# EasyEDA Pro project ProProject_myXBoxGamepad_2024-06-05.epro, board PCB1_1
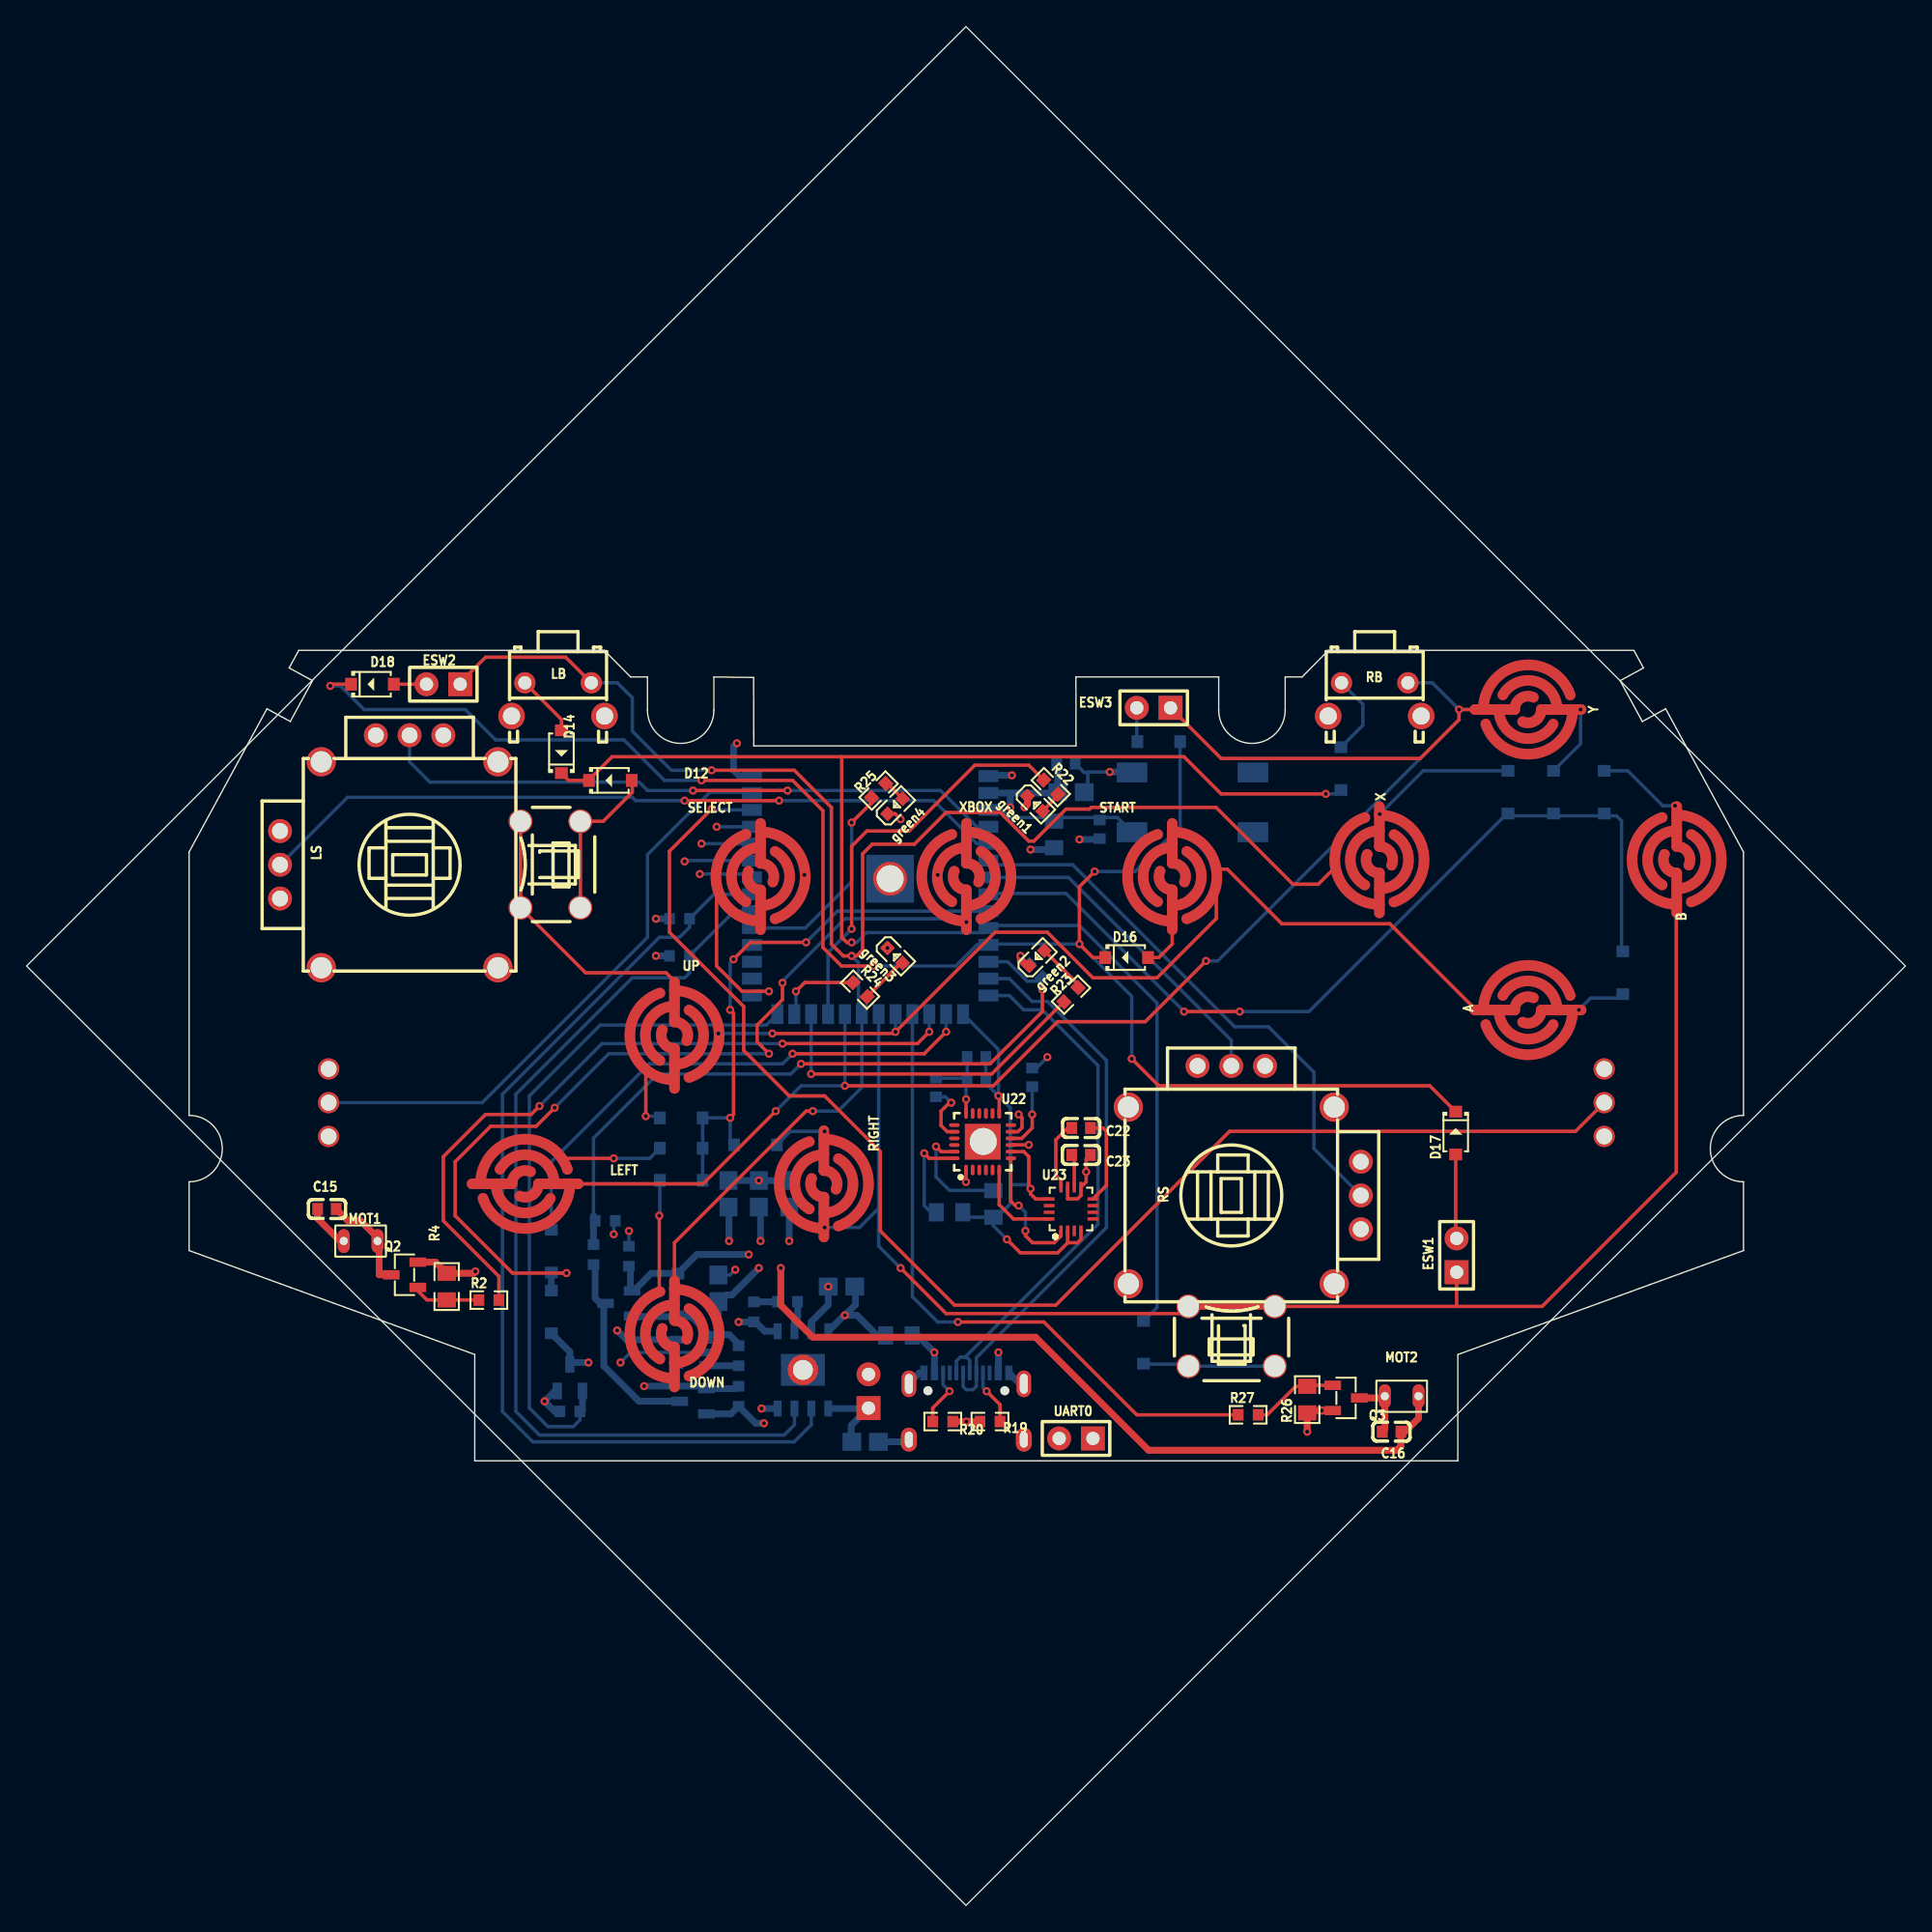
[diagram p1: board, top side]
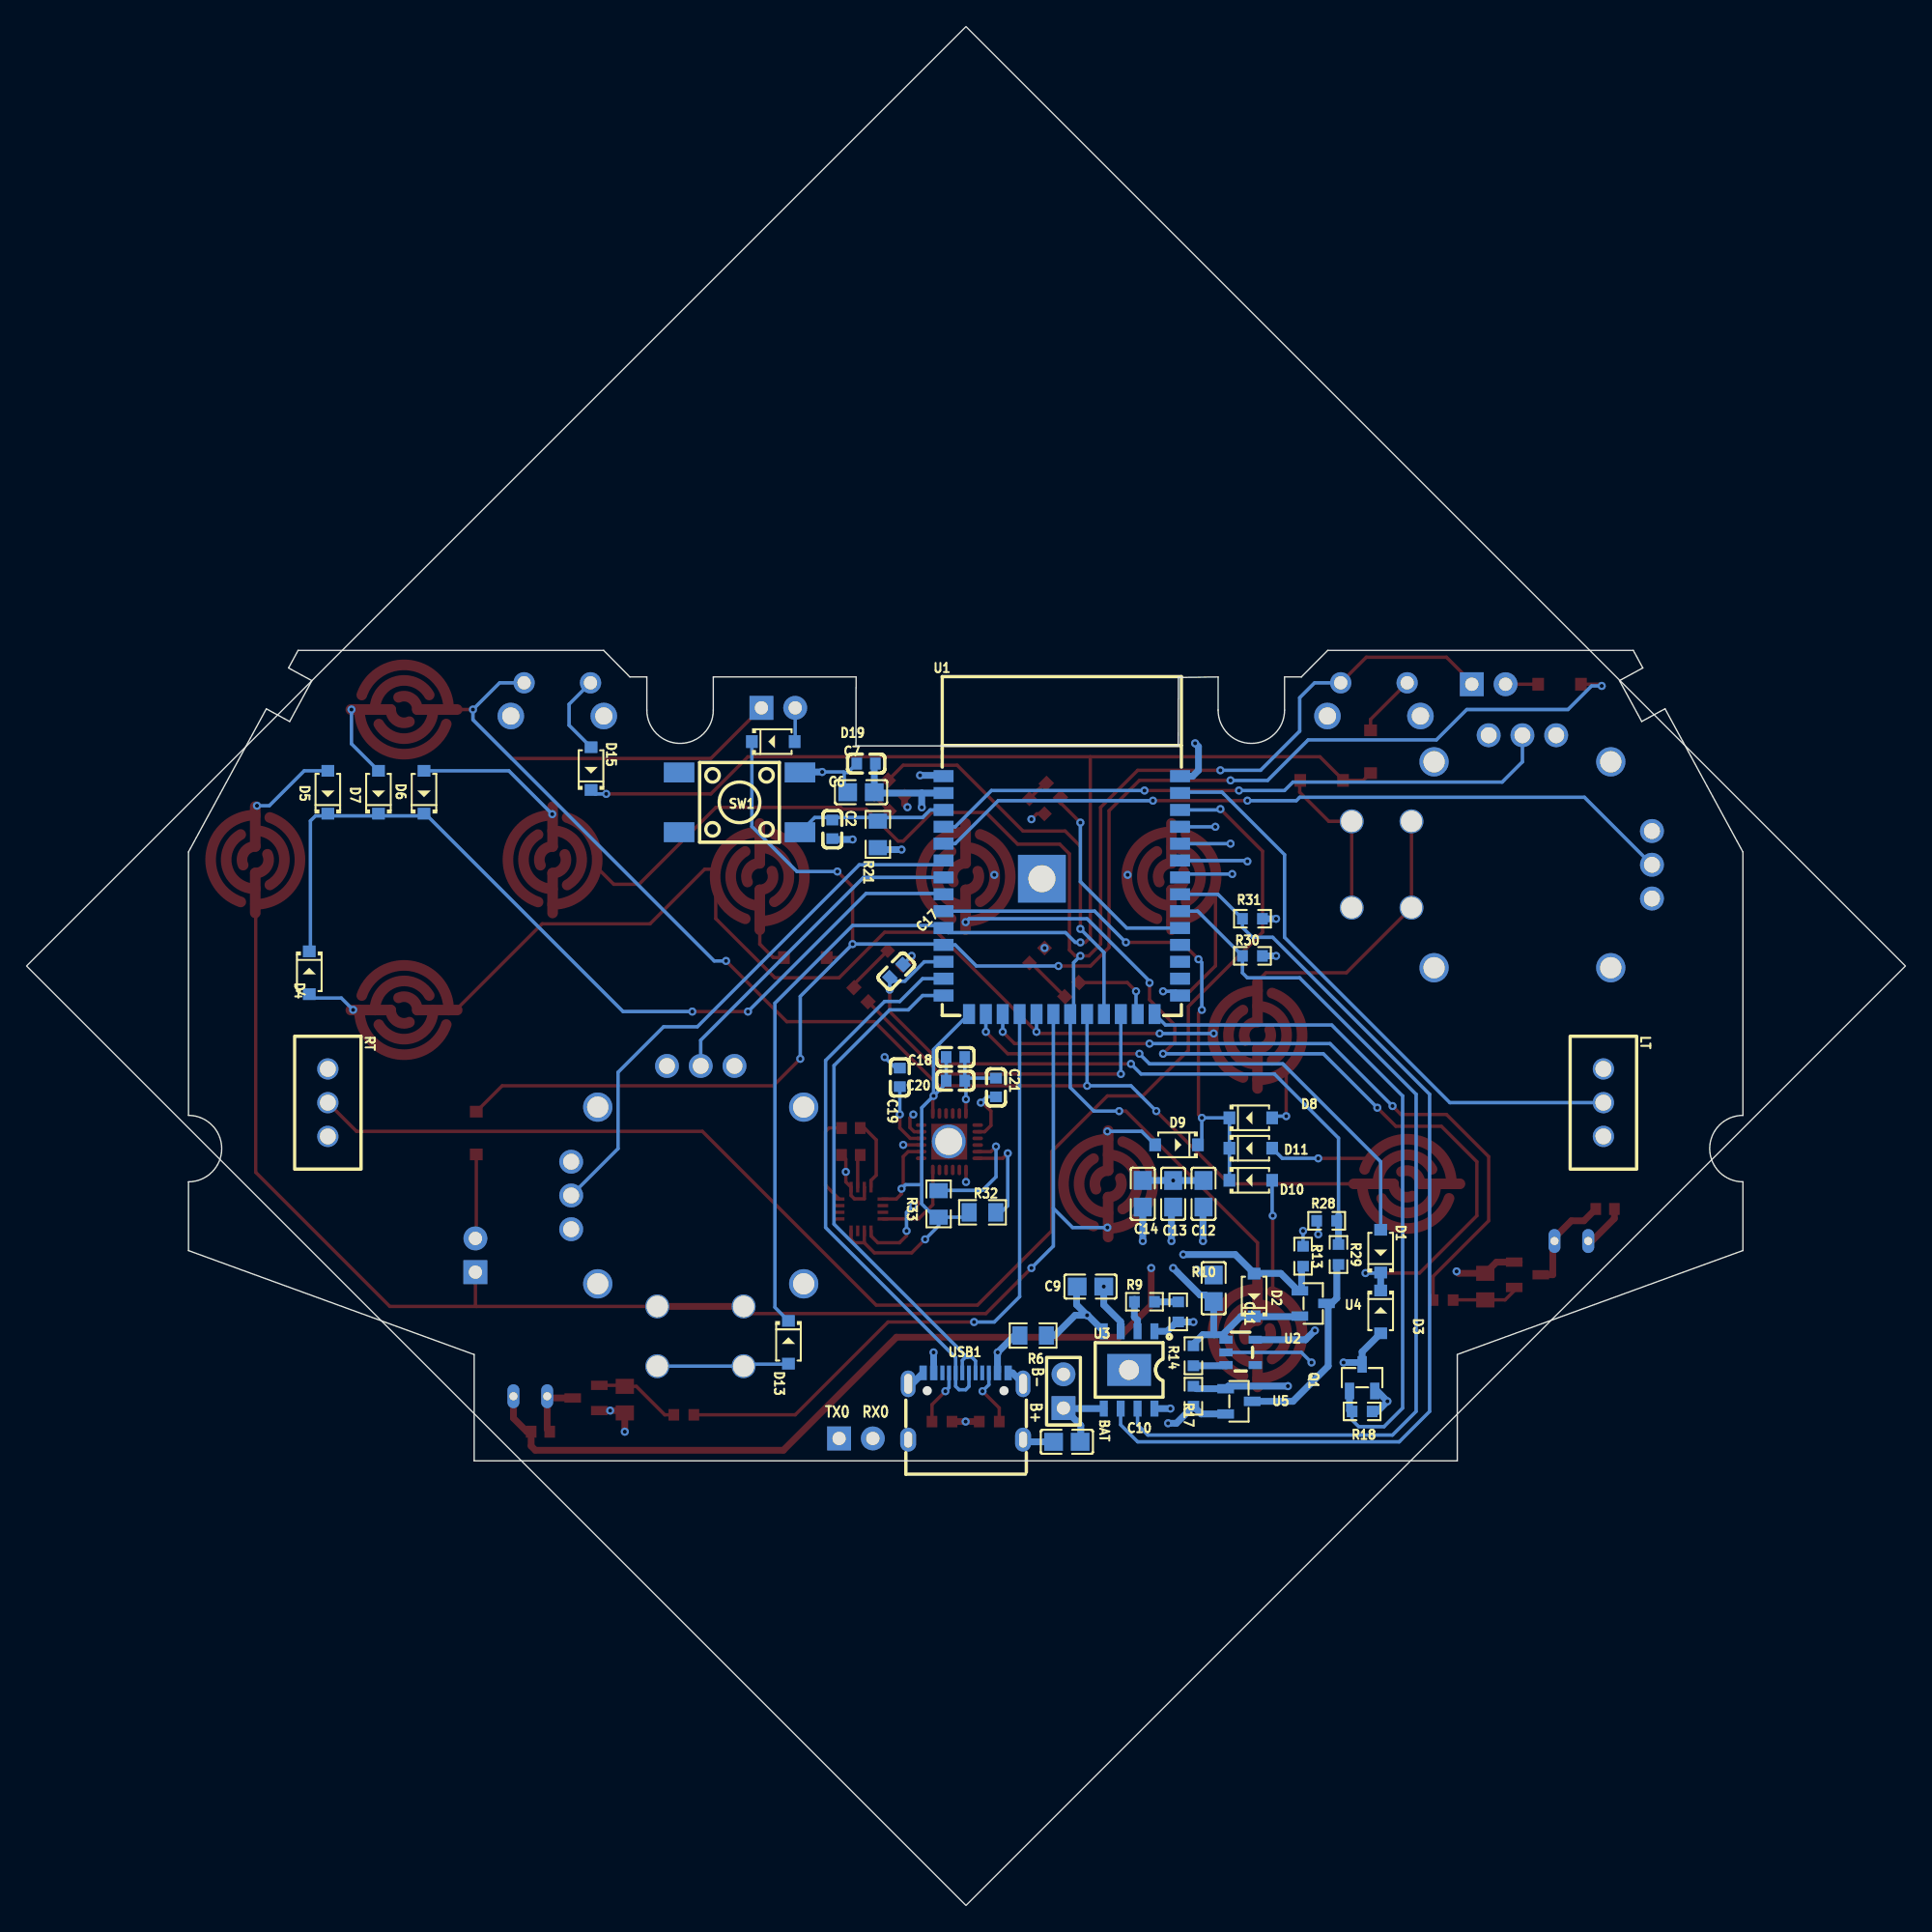
[diagram p2: board, bottom side, seen from below]

Outline 141.42 x 141.42 mm; copper layers: Top Layer, 电源层, GND, Bottom Layer. Coordinates in mm from the lower left corner of the outline.
Outline path: 0,70.71 70.71,141.42 141.42,70.71 70.71,0 closed ; 12.23,79.29 12.23,59.47 arc(14.73,56.97) 12.23,54.47 12.23,49.29 33.73,41.47 33.73,33.47 107.73,33.47 107.73,41.47 129.23,49.29 129.23,54.47 arc(126.73,56.97) 129.23,59.47 129.23,79.29 123.37,90.07 121.62,89.11 119.95,92.19 121.7,93.14 120.98,94.47 97.98,94.47 96.01,92.47 94.73,92.47 94.73,89.97 arc(92.23,87.47) 89.73,89.97 89.73,92.47 78.98,92.47 78.99,87.28 54.74,87.28 54.73,92.43 51.73,92.47 51.73,89.97 arc(49.23,87.47) 46.73,89.97 46.73,92.47 45.47,92.47 43.48,94.47 20.48,94.47 19.76,93.14 21.52,92.19 19.85,89.11 18.09,90.07 12.23,79.29
Stack: Top Layer 0.035mm 外层铜厚1oz / Dielectric1 0.2104mm 7628 RC49% 8.6mil / 电源层 0.0152mm 内层铜厚 / Dielectric2 1.065mm 1.1mm H/HOZ 含铜 / GND 0.0152mm 内层铜厚 / Dielectric3 0.2104mm 7628 RC49% 8.6mil / Bottom Layer 0.035mm 外层铜厚1oz

## Design rules (mm)
template: 自定义配置
spacing copperThickness1oz (default): track to track 0.102, other pairs 0.152 to 0.3
spacing copperThickness2oz: track to track 0.203, other pairs 0.152 to 0.3
track width copperThickness1oz (default): min 0.127, default 0.254, max 2.54
track width copperThickness2oz: min 0.203, default 0.254, max 2.54
differential pair differentialPair (default): width min 0.127, default 0.254, max 2.54; gap min 0.152, default 0.152
via viaSize (default): diameter min 0.5, default 0.61, max 10; hole min 0.3, default 0.305, max 6.299

## Placement (name value [footprint] x y rotation side)
A  key  [导电硅胶按键08]  113.01 67.4 90 top
B  key  [导电硅胶按键08]  124.21 78.71 180 top
BAT  SB2P-HVQ-CA(LF)(SN)  [HDR-TH_2P-P2.54-V-M-1]  63.37 38.71 90 bottom
C2  1uF  [C0603]  80.77 81 270 bottom
C6  22uF  [C0805]  78.61 83.79 0 bottom
C7  100nF  [C0603]  78.23 85.95 0 bottom
C9  10uF  [C0805]  61.34 46.58 180 bottom
C10  10uF  [C0805]  63.12 34.9 0 bottom
C11  10uF  [C0805]  52.07 46.45 90 bottom
C12  10uF  [C0805]  52.83 53.57 90 bottom
C13  10uF  [C0805]  55.12 53.57 90 bottom
C14  10uF  [C0805]  57.4 53.57 90 bottom
C15  1uF  [C0603]  22.61 52.42 180 top
C16  1uF  [C0603]  102.74 35.66 0 top
C17  100nF  [C0603]  75.95 70.33 135 bottom
C18  100nF  [C0603]  71.5 63.85 180 bottom
C19  100nF  [C0603]  75.69 62.33 90 bottom
C20  10nF  [C0603]  71.5 62.07 180 bottom
C21  2.2nF  [C0603]  68.45 61.57 270 bottom
C22  0.22uF  [C0603]  79.37 58.52 180 top
C23  0.22uF  [C0603]  79.37 56.49 0 top
D1  1N5819W  [SOD-123_L2.7-W1.6-LS3.7-FD]  39.5 49.25 270 bottom
D2  1N5819W  [SOD-123_L2.7-W1.6-LS3.7-FD]  49.02 45.95 270 bottom
D3  1N5819W  [SOD-123_L2.7-W1.6-LS3.7-FD]  39.5 44.68 90 bottom
D4  1N5819W  [SOD-123_L2.7-W1.6-LS3.7-FD]  120.14 70.2 90 bottom
D5  1N5819W  [SOD-123_L2.7-W1.6-LS3.7-FD]  118.74 83.79 270 bottom
D6  1N5819W  [SOD-123_L2.7-W1.6-LS3.7-FD]  111.51 83.79 270 bottom
D7  1N5819W  [SOD-123_L2.7-W1.6-LS3.7-FD]  114.93 83.79 270 bottom
D8  1N5819W  [SOD-123_L2.7-W1.6-LS3.7-FD]  49.28 59.28 0 bottom
D9  1N5819W  [SOD-123_L2.7-W1.6-LS3.7-FD]  54.86 57.25 180 bottom
D10  1N5819W  [SOD-123_L2.7-W1.6-LS3.7-FD]  49.28 54.58 0 bottom
D11  1N5819W  [SOD-123_L2.7-W1.6-LS3.7-FD]  49.28 56.99 0 bottom
D12  1N5819W  [SOD-123_L2.7-W1.6-LS3.7-FD]  43.94 84.68 180 top
D13  1N5819W  [SOD-123_L2.7-W1.6-LS3.7-FD]  84.07 42.39 90 bottom
D14  1N5819W  [SOD-123_L2.7-W1.6-LS3.7-FD]  40.26 86.84 270 top
D15  1N5819W  [SOD-123_L2.7-W1.6-LS3.7-FD]  98.93 85.57 270 bottom
D16  1N5819W  [SOD-123_L2.7-W1.6-LS3.7-FD]  82.8 71.35 180 top
D17  1N5819W  [SOD-123_L2.7-W1.6-LS3.7-FD]  107.57 58.14 90 top
D18  1N5819W  [SOD-123_L2.7-W1.6-LS3.7-FD]  26.03 91.92 180 top
D19  1N5819W  [SOD-123_L2.7-W1.6-LS3.7-FD]  85.22 87.6 0 bottom
DOWN  key  [导电硅胶按键08]  48.77 43.02 0 top
ESW1  SB2P-HVQ-CA(LF)(SN)  [HDR-TH_2P-P2.54-V-M-1]  107.64 48.94 90 top
ESW2  SB2P-HVQ-CA(LF)(SN)  [HDR-TH_2P-P2.54-V-M-1]  31.37 91.92 180 top
ESW3  SB2P-HVQ-CA(LF)(SN)  [HDR-TH_2P-P2.54-V-M-1]  84.84 90.14 180 top
green1  -  [LED_0603]  75.95 82.9 315 top
green2  -  [LED_0603]  76.07 71.35 45 top
green3  -  [LED_0603]  65.4 71.47 315 top
green4  -  [LED_0603]  65.4 82.78 45 top
LB  -  [侧插式两脚开关]  40 90.78 180 top
LEFT  key  [导电硅胶按键08]  37.53 54.31 270 top
LS  THB001P  [SW-TH_THB001P]  28.83 78.33 90 top
LT  -  [3*2.54mm]  22.73 60.42 270 bottom
MOT1  -  [VIBRATING-MOTOR-SMD_WELDING]  25.15 50.01 180 top
MOT2  -  [VIBRATING-MOTOR-SMD_WELDING]  103.5 38.33 0 top
NOREF  -  [Pad_e1298]  65 77.28 90 top
NOREF#2  -  [Pad_e154]  58.43 40.31 90 top
NOREF#3  -  [Pad_e508]  72.01 57.5 90 top
Q1  SI2302  [SOT-23-3_L2.9-W1.3-P1.90-LS2.4-BR]  40.89 39.72 270 bottom
Q2  SI2302  [SOT-23-3_L2.9-W1.3-P1.90-LS2.4-BR]  28.45 47.47 0 top
Q3  SI2302  [SOT-23-3_L2.9-W1.3-P1.90-LS2.4-BR]  99.31 38.2 180 top
R2  2  [R0603]  34.8 45.56 0 top
R4  10K  [R0805]  31.62 46.58 270 top
R6  0.5  [R0805]  65.66 42.9 180 bottom
R9  1K  [R0603]  57.28 45.44 180 bottom
R10  1K  [R0603]  54.74 44.68 270 bottom
R13  100K  [R0603]  45.34 48.87 270 bottom
R14  100K  [R0603]  53.59 41.37 270 bottom
R17  100K  [R0603]  53.59 38.33 90 bottom
R18  100K  [R0603]  40.89 37.18 180 bottom
R19  5.1K  [R0603]  72.52 36.42 0 top
R20  5.1K  [R0603]  68.96 36.42 180 top
R21  10K  [R0805]  77.34 80.62 90 bottom
R22  5.1K  [R0603]  77.09 84.17 135 top
R23  5.1K  [R0603]  78.61 68.55 225 top
R24  5.1K  [R0603]  62.74 68.93 135 top
R25  5.1K  [R0603]  64.14 83.92 225 top
R26  10K  [R0805]  96.39 38.07 90 top
R27  2  [R0603]  91.95 36.93 0 top
R28  100K  [R0603]  43.56 51.53 180 bottom
R29  100K  [R0603]  42.67 48.99 270 bottom
R30  100K  [R0603]  49.15 71.47 180 bottom
R31  100K  [R0603]  49.15 74.27 180 bottom
R32  10K  [R0805]  69.47 52.17 0 bottom
R33  10K  [R0805]  72.77 52.8 90 bottom
RB  -  [侧插式两脚开关]  101.47 90.78 180 top
RIGHT  key  [导电硅胶按键08]  60.01 54.31 180 top
RS  THB001P  [SW-TH_THB001P]  90.68 53.44 0 top
RT  -  [3*2.54mm]  118.74 60.42 270 bottom
SELECT  BOOT_BTN  [导电硅胶按键08]  55.24 77.44 0 top
START  key  [导电硅胶按键08]  86.23 77.44 0 top
SW1  -  [SW-SMD_4P-L6.0-W6.0-P4.50-LS9.0-2]  87.76 83.03 180 bottom
U1  2.4GHz  [wifim-smd_esp32-s3-wroom-1-n8]  63.5 76.04 180 bottom
U2  TPAP2112K-3.3TRG1  [SOT-23-5_L2.9-W1.6-P0.95-LS2.8-BR]  50.04 41.63 0 bottom
U3  TP4056  [ESOP-8_L4.9-W3.9-P1.27-LS6.0-BL-EP]  58.43 40.31 0 bottom
U4  SI2305  [SOT-23-3_L2.9-W1.3-P1.90-LS2.4-BR]  44.58 45.31 0 bottom
U5  SI2305  [SOT-23-3_L2.9-W1.3-P1.90-LS2.4-BR]  50.17 37.94 0 bottom
U22  MPU-6050  [qfn-24_l4.0-w4.0-p0.50-bl-ep2.7]  71.96 57.49 0 top
U23  QMC5883L  [lga-16_l3.0-w3.0-p0.50-bl_sq]  78.61 52.42 0 top
UART0  SB2P-HVQ-CA(LF)(SN)  [HDR-TH_2P-P2.54-V-M-1]  78.99 35.15 180 top
UP  key  [导电硅胶按键08]  48.77 65.5 0 top
USB1  TYPE-C 16PIN 2MD(073)  [usb-c-smd_type-c-6pin-2md-073]  70.74 37.44 180 bottom
X  key  [导电硅胶按键08]  101.83 78.71 180 top
XBOX  key  [导电硅胶按键08]  70.74 77.44 0 top
Y  key  [导电硅胶按键08]  113.01 90.02 90 top

## Footprints (pads in the part's own frame, mm; a bottom-side part is the same pattern mirrored in y, then rotated)
3*2.54mm
  round 1.6 hole 1.2: 1(-2.54,0) 2(0,0) 3(2.54,0)
C0603
  rect 0.8x0.9 smd: 1(-0.7,0) 2(0.7,0)
C0805
  rect 1.41x1.35 smd: 1(-1,0) 2(1,0)
ESOP-8_L4.9-W3.9-P1.27-LS6.0-BL-EP
  rect 0.6x1.2 smd: 1(-1.905,-2.909) 2(-0.635,-2.909) 3(0.635,-2.909) 4(1.905,-2.909) 5(1.905,2.909) 6(0.635,2.909) 7(-0.635,2.909) 8(-1.905,2.909)
  rect 3.3x2.4 smd: 9(0,0)
HDR-TH_2P-P2.54-V-M-1
  rect 1.8x1.8 hole 1: 1(-1.27,0)
  round 1.8 hole 1: 2(1.27,0)
LED_0603
  rect 0.8x0.8 smd: 1(-0.851,-0.01) 2(0.75,-0.005)
lga-16_l3.0-w3.0-p0.50-bl_sq
  rect 0.25x0.8 smd: 1(-0.75,-1.644) 2(-0.25,-1.644) 3(0.25,-1.644) 4(0.75,-1.644) 9(0.75,1.644) 10(0.25,1.644) 11(-0.25,1.644) 12(-0.75,1.644)
  rect 0.8x0.25 smd: 5(1.644,-0.75) 6(1.644,-0.25) 7(1.644,0.25) 8(1.644,0.75) 13(-1.644,0.75) 14(-1.644,0.25) 15(-1.644,-0.25) 16(-1.644,-0.75)
Pad_e154
  round 2.286 hole 1.5: 42(0,0)
Pad_e508
  round 2.54 hole 2.032: 42(0,0)
Pad_e1298
  round 2.54 hole 2.032: 42(0,0)
qfn-24_l4.0-w4.0-p0.50-bl-ep2.7
  oval 0.28x0.8 smd: 1(-1.25,-2.127) 2(-0.75,-2.127) 3(-0.25,-2.127) 4(0.25,-2.127) 5(0.75,-2.127) 6(1.25,-2.127) 13(1.25,2.127) 14(0.75,2.127) 15(0.25,2.127) 16(-0.25,2.127) 17(-0.75,2.127) 18(-1.242,2.127)
  oval 0.8x0.28 smd: 7(2.127,-1.25) 8(2.127,-0.75) 9(2.127,-0.25) 10(2.127,0.25) 11(2.127,0.75) 12(2.127,1.25) 19(-2.127,1.25) 20(-2.127,0.75) 21(-2.127,0.25) 22(-2.127,-0.25) 23(-2.127,-0.75) 24(-2.127,-1.25)
  rect 2.7x2.7 smd: 25(0.013,0)
R0603
  rect 0.806x0.864 smd: 1(-0.753,0) 2(0.753,0)
R0805
  rect 1.133x1.377 smd: 1(-1,0) 2(1,0)
SOD-123_L2.7-W1.6-LS3.7-FD
  rect 0.88x0.96 smd: 1(-1.61,0) 2(1.61,0)
SOT-23-3_L2.9-W1.3-P1.90-LS2.4-BR
  rect 1.25x0.7 smd: 1(1,-0.95) 2(1,0.95) 3(-1,0)
SOT-23-5_L2.9-W1.6-P0.95-LS2.8-BR
  rect 1x0.6 smd: 1(1.1,-0.95) 2(1.1,0) 3(1.1,0.95) 4(-1.1,0.95) 5(-1.1,-0.95)
SW-SMD_4P-L6.0-W6.0-P4.50-LS9.0-2
  rect 2.3x1.5 smd: 1(-4.55,2.25) 2(4.55,2.25) 3(-4.55,-2.25) 4(4.55,-2.25)
SW-TH_THB001P
  round 1.8 hole 1.2: 1(9.75,-2.54) 2(9.75,0) 3(9.75,2.54) 4(2.54,9.75) 5(0,9.75) 6(-2.54,9.75)
  round 2.2 hole 1.6: 7(-7.75,6.65) 8(-7.75,-6.65) 9(7.75,-6.65) 10(7.75,6.65)
  round 1.8 hole 1.6x1.2: a(-3.23,-8.35) b(3.27,-8.35) c(-3.23,-12.85) d(3.27,-12.85)
usb-c-smd_type-c-6pin-2md-073
  rect 0.55x1.1 smd: 1(-3.2,2.648) 2(-2.4,2.646) 11(2.4,2.646) 12(3.2,2.646)
  rect 0.3x1.1 smd: 3(-1.75,2.646) 4(-1.25,2.646) 5(-0.75,2.646) 6(-0.25,2.646) 7(0.25,2.646) 8(0.75,2.646) 9(1.25,2.646) 10(1.75,2.646)
  oval 1.2x1.8 hole 0.6x1.2: 13(-4.325,-2.375) 14(4.325,-2.375)
  oval 1.1x2 hole 0.6x1.5: 13(-4.325,1.825) 14(4.325,1.825)
VIBRATING-MOTOR-SMD_WELDING
  oval 0.9x1.8 hole 0.61: 1(-1.27,0) 2(1.27,0)
wifim-smd_esp32-s3-wroom-1-n8
  rect 1.5x0.9 smd: 1(-8.9,8.954) 2(-8.9,7.684) 3(-8.9,6.415) 4(-8.9,5.144) 5(-8.9,3.874) 6(-8.9,2.604) 7(-8.9,1.335) 8(-8.9,0.065) 9(-8.9,-1.206) 10(-8.9,-2.475) 11(-8.9,-3.745) 12(-8.9,-5.016) 13(-8.9,-6.285) 14(-8.9,-7.556) 27(8.9,-7.556) 28(8.9,-6.285) 29(8.9,-5.016) 30(8.9,-3.745) 31(8.9,-2.475) 32(8.9,-1.206) 33(8.9,0.065) 34(8.9,1.335) 35(8.9,2.604) 36(8.9,3.874) 37(8.9,5.144) 38(8.9,6.415) 39(8.9,7.684) 40(8.9,8.954)
  rect 0.9x1.5 smd: 15(-6.985,-8.954) 16(-5.715,-8.954) 17(-4.445,-8.954) 18(-3.175,-8.954) 19(-1.905,-8.954) 20(-0.635,-8.954) 21(0.635,-8.954) 22(1.905,-8.954) 23(3.175,-8.954) 24(4.445,-8.954) 25(5.715,-8.954) 26(6.985,-8.954)
  rect 3.6x3.6 smd: 41(-1.5,1.235)
侧插式两脚开关
  round 1.6 hole 1: 1(-2.5,-1.25) 2(2.5,-1.25)
  round 2 hole 1.3: NC(-3.5,1.25) NC(3.5,1.25)
导电硅胶按键08
  custom 2.99x4.886 smd: 1(-2.115,0.568)
  custom 0.8x3.8 smd: 1(0,2.5) 2(0,-2.5)
  custom 1.805x2.213 smd: 1(0.843,0.547)
  custom 4.16x7.338 smd: 1(3.314,0.554) 2(-3.314,-0.553)
  custom 1.8x2.206 smd: 2(-0.839,-0.545)
  custom 2.991x4.887 smd: 2(2.116,-0.569)

## Nets
As in the schematic, except:
GND: BAT.2 C2.2 C6.2 C7.2 C9.2 C10.2 C11.2 C12.2 C13.2 C14.2 C17.2 C18.2 C19.2 C20.2 C21.1 C23.2 green1.1 green2.1 green3.1 green4.1 LS.1 LS.4 LT.3 NOREF.42 NOREF#2.42 NOREF#3.42 Q1.2 Q2.2 Q3.2 R4.1 R10.2 R13.1 R18.2 R19.1 R20.1 R26.1 R28.1 RS.1 RS.4 RT.3 SELECT.1 SW1.2 U1.1 U1.40 U1.41 U2.2 U3.1 U3.3 U3.9 U22.1 U22.9 U22.11 U22.18 U22.25 U23.9 U23.11 USB1.1 USB1.12 USB1.13 USB1.14 XBOX.1

Pads without a net: LB NC; LS 7 8 9 10; RB NC; RS 7 8 9 10; SW1 1 3; U2 4; U22 2 3 4 5 12 14 15 16 17 19 21 22; U23 3 5 6 7 14 15; USB1 3 9

## Via types
v1: diameter 0.61, hole 0.305, Top Layer to Bottom Layer, 118 vias

## Routing (per net, layer and track width the routed paths; a pad name or vN(x,y) marks a point on that pad's centre or on a via; arc(x,y) is an arc through that point)
3.3V: length 235.3
  电源层 w0.508: 76.2,61.19 80.26,65.25 88.14,65.25 ; 76.2,61.19 76.71,60.68 76.71,56.36 72.9,52.55 68.71,52.55 66.17,50.01 v1(57.4,50.01) v1(55.24,50.01) v1(52.87,50.01) 50.04,50.01 48.83,48.8 ; 76.2,61.19 74.04,63.34 74.04,79.63 ; RS.3 100.43,60.93 ; 100.43,60.93 116.71,60.93 RT.1 ; 100.43,60.93 100.33,60.93 96.01,65.25 88.14,65.25 ; 88.14,65.25 RS.6 ; 39.12,58.52 39.24,58.52 47.37,66.65 v1(47.37,71.47) v1(47.37,74.27) ; 39.12,58.52 33.53,58.52 29.08,62.96 LT.1 16.38,69.31 16.38,75.79 ; 39.12,58.52 48.83,48.8 ; 16.38,75.79 16.38,83.92 20.57,88.11 26.26,88.11 LS.3 ; 16.38,75.79 19.08,75.79 ; 74.04,79.63 v1(74.04,82.65) ; 74.04,79.63 74.2,79.47 v1(75.56,79.47) ; 48.83,48.8 44.45,44.42 v1(44.45,43.28)
  Bottom Layer w0.508: 74.04,83.73 77.55,83.73 C6.1 77.61,85.87 C7.1 ; 74.04,83.73 v1(74.04,82.65) ; 74.04,83.73 U1.2 ; v1(44.45,43.28) 45.15,42.58 U2.5 ; v1(47.37,71.47) R30.2 ; v1(55.24,50.01) 55.24,52.44 C13.1 ; v1(52.87,50.01) 52.87,52.52 C12.1 ; v1(47.37,74.27) R31.2 ; v1(57.4,50.01) C14.1 ; R21.1 77.2,79.47 v1(75.56,79.47)
GND: length 76.3
  Top Layer w0.254: v1(74.68,59.53) 74.93,59.28 74.93,58.55 74.61,58.24 U22.11 ; 70.72,59.61 v1(70.72,60.68) ; v1(65.79,81.76) 65.38,82.17 green4.1 ; v1(75.44,57.25) 74.1,57.25 U22.9 ; U22.1 v1(70.71,54.45) ; 80.08,56.49 79.76,56.17 v1(79.76,55.22) 79.76,54.46 U23.9 79.36,53.44 79.11,53.18 78.36,53.18 78.36,54.06 U23.11
  Top Layer w0.508: R20.1 v1(70.74,36.42) R19.1 ; 75.34,83.5 75.34,82.89 v1(75.12,82.67) ; 75.48,70.74 75.48,70.52 74.8,71.2 v1(74.8,71.47) ; v1(33.78,47.72) 33.64,47.58 31.62,47.58 30.78,48.42 29.07,48.42 ; v1(96.39,35.66) R26.1 96.57,37.25 v1(97.49,37.25) 98.31,37.25
  Bottom Layer w0.254: C20.2 C18.2 ; C20.2 70.72,61.99 v1(70.72,60.68) 70.61,60.68 ; C20.2 70.61,62.27 C21.1 ; v1(76.83,63.85) 76.01,63.03 C19.2 ; v1(81.53,85.32) 79.91,85.32 79.88,85.28 ; C6.2 79.88,84.06 79.88,85.28 ; v1(44.2,50.52) 44.2,51.42 R28.1 ; v1(44.7,40.87) 45.47,41.63 U2.2 ; C11.2 52.94,47.45 v1(53.34,47.85) ; v1(74.8,71.47) C17.2 ; 79.88,85.28 79.6,85.28 C7.2 ; R13.1 v1(45.34,50.77)
  Bottom Layer w0.508: C10.2 66.29,34.9 66.42,35.02 ; 66.41,39.29 67.21,40.08 USB1.12 ; 73.94,40.08 74.76,39.26 USB1.13 ; 83.21,85.28 83.17,85.32 v1(81.53,85.32) ; Q1.2 39.77,38.72 v1(38.99,37.94) 39.75,37.18 R18.2 ; v1(60.34,46.58) 60.34,45.21 59.07,43.93 U3.3 ; 54.6,43.91 54.86,43.91 55.56,43.22 U3.1 ; 54.6,43.91 v1(53.59,43.91) ; 54.6,43.91 54.61,43.92 ; v1(79.25,80.24) 80.71,80.24 C2.2 ; v1(53.47,87.47) 53.21,87.22 53.21,85.44 53.66,85 U1.40 ; U1.1 72.46,85.06 v1(74.17,85.06) ; C14.2 v1(55.12,54.57) C12.2
  vias: v1(58.55,77.57) v1(64.8,72.07) v1(68.58,77.57)
VBAT: length 18.9
  电源层 w0.508: v1(55.5,36.29) 62.05,36.29 63.03,37.4
  Bottom Layer w0.508: U5.2 53.02,36.99 R17.1 54.87,36.29 v1(55.5,36.29) ; BAT.1 62.07,36.14 62.07,34.88 ; 63.03,37.4 U3.5
VBAT_1: length 14.8
  Bottom Layer w0.508: U5.3 46.1,37.94 43.45,40.6 43.45,45.06 42.8,45.71 42.8,48.11 R29.2
A_1: length 95.5
  Top Layer w0.254: LS.b LS.a 42.08,70.2 48.13,70.2 48.77,69.57 48.77,69.37 ; 111.17,67.43 109.07,67.43 102.62,73.89 94.49,73.89 90.38,78 START.1 89.55,74.28 85.09,69.82 80.26,69.82 76.83,73.25 72.9,73.25 v1(65.4,65.76) 65.28,65.63 v1(56.13,65.63)
  Bottom Layer w0.254: v1(65.4,65.76) U1.19 ; v1(52.07,65.63) v1(56.13,65.63)
A_2: length 3.8
  Bottom Layer w0.254: v1(116.84,67.41) 117.73,68.3 119.85,68.3 D4.1
B_1: length 112.3
  Top Layer w0.254: B.1 124.17,76.18 124.17,55.18 114.08,45.09 107.56,45.09 ; v1(65.79,47.98) 69.21,44.55 86.91,44.55 RS.a ; ESW1.1 107.64,45.17 107.56,45.09 ; 107.56,45.09 RS.b
  Top Layer w0.508: RS.b RS.a
  Bottom Layer w0.254: 64.14,52.47 62.69,51.03 v1(60.07,51.03) ; 64.14,52.47 64.14,49.63 v1(65.79,47.98) ; 64.14,52.47 64.14,67.09
B_2: length 6.4
  Bottom Layer w0.254: v1(124.08,82.78) 123.15,82.78 120.52,85.4 D5.1
BOOT: length 12.3
  Top Layer w0.254: SELECT.2 51.93,70.72 53.85,68.81 v1(55.88,68.81)
  Bottom Layer w0.254: U1.27 54.92,68.81 v1(55.88,68.81)
D+: length 39.7
  Bottom Layer w0.254: 69.99,40.07 69.99,40.98 70.28,41.28 70.74,41.28 70.99,41.03 70.99,40.07 ; 70.61,41.25 80.64,51.28 80.64,63.22 76.45,67.41 75.06,67.41 73.98,68.49 U1.14
D-: length 42.2
  Bottom Layer w0.254: 70.49,40.07 70.49,39.06 70.74,38.81 71.23,38.81 71.49,39.08 71.49,40.07 ; U1.13 73.98,69.76 75.69,68.04 76.83,68.04 81.28,63.6 81.28,51.03 71.49,41.23 USB1.5
DOWN_1: length 130.7
  Top Layer w0.254: v1(59.18,59.79) 58.67,59.79 48.77,49.88 DOWN.1 ; v1(51.56,85.44) 57.78,85.44 60.58,82.65 60.58,72.36 61.47,71.47 v1(62.1,71.47) 62.48,71.47 62.93,71.92 62.93,79.15 63.65,79.88 66.82,79.88 69.21,82.27 73.28,82.27 75.44,80.11 75.82,80.11 78.23,82.52 80.01,82.52 80.14,82.65 89.53,82.65 95.32,76.86 97.23,76.86 X.1 ; LB.1 40.58,93.95 34.54,93.95 32.64,92.05 ESW2.1
  Bottom Layer w0.254: v1(59.18,59.79) 61.09,59.79 62.86,61.57 U1.21 62.61,67.34 62.61,70.96 v1(62.1,71.47) ; v1(51.56,85.44) 48.54,85.44 45.59,88.39 45.59,90.9 44.47,92.03 LB.1
DOWN_2: length 8.5
  Top Layer w0.254: 47.62,47.18 47.62,46.45 47.37,46.2 ; v1(47.62,51.91) 47.62,47.22
  Bottom Layer w0.254: v1(47.62,51.91) 47.67,51.96 D10.1
GPIO1: length 45.2
  Bottom Layer w0.254: LT.2 34.29,60.42 46.74,72.87 46.74,79.09 51.43,83.79 54.54,83.79 U1.39
GPIO2: length 107.4
  Top Layer w0.254: RT.2 116.59,58.26 90.55,58.26 77.47,45.18 69.85,45.18 64.26,50.77 64.26,56.74 60.07,60.93 57.4,60.93 53.98,64.36 53.98,67.66 48.39,73.25 48.39,79.35 v1(51.56,82.52)
  Bottom Layer w0.254: U1.38 51.62,82.46 v1(51.56,82.52)
GPIO3: length 42.3
  Top Layer w0.254: 78.36,49.88 77.61,49.12 74.8,49.12 v1(73.79,50.14) ; 78.36,49.88 78.36,50.78 ; 78.36,49.88 78.37,49.88 79.11,49.88 79.36,50.14 79.36,50.78 ; v1(73.15,60.93) 73.21,60.87 73.21,59.61 ; U23.13 75.95,53.17 75.56,53.56 v1(75.56,53.95) 75.44,54.07 75.44,56.36 75.06,56.74 U22.8
  Bottom Layer w0.254: R32.2 70.83,51.8 R33.1 ; 74.04,54.25 74.04,60.04 v1(73.15,60.93) ; 74.04,54.25 75.26,54.25 v1(75.56,53.95) ; 74.04,54.25 74.04,52.8 72.91,51.67 R33.1 ; U1.15 73.15,64.42 v1(73.15,60.93) ; R33.1 72.77,51.15 v1(73.79,50.14) ; v1(73.15,60.93) 72.2,61.88 C20.1 C18.1
GPIO4: length 47.6
  Top Layer w0.254: v1(50.17,83.92) v1(57.28,83.92)
  Bottom Layer w0.254: LS.2 28.83,86.08 30.35,84.55 46.1,84.55 46.74,83.92 v1(50.17,83.92) ; v1(57.28,83.92) 68.79,83.92 71.52,81.19 U1.4
GPIO5: length 56.9
  Top Layer w0.254: v1(56.64,83.16) v1(49.53,83.16)
  Bottom Layer w0.254: U1.5 71.52,79.92 68.29,83.16 v1(56.64,83.16) ; v1(49.53,83.16) 45.85,83.16 45.59,83.41 24.16,83.41 LS.5
GPIO6: length 41.8
  Bottom Layer w0.254: RS.2 96.9,56.97 96.9,62.71 93.47,66.14 90.93,66.14 78.74,78.33 72.72,78.33 U1.6
GPIO7: length 25.3
  Bottom Layer w0.254: U1.7 78.42,77.38 90.68,65.12 RS.5
GPIO8: length 53.1
  Top Layer w0.254: v1(76.45,68.93) 76.45,67.28 72.52,63.34 v1(58.29,63.34)
  Bottom Layer w0.254: v1(76.45,68.93) 76.45,69.82 C17.1 76.17,69.57 75.31,69.57 73.85,71.03 U1.12 ; v1(58.29,63.34) 57.53,62.58 47.5,62.58 42.67,57.76 42.67,51.92
  Bottom Layer w0.508: R29.1 42.67,51.92
GPIO9: length 54.3
  Top Layer w0.254: v1(67.95,65.76) 67.06,64.87 v1(56.9,64.87) ; 35.56,45.57 R2.2 35.55,47.35 31.37,51.53 31.37,56.36 34.54,59.53 37.97,59.53 v1(38.61,60.17)
  Bottom Layer w0.254: v1(56.9,64.87) 43.31,64.87 v1(38.61,60.17) ; v1(67.95,65.76) U1.17
GPIO10: length 49.5
  Top Layer w0.254: v1(70.1,43.91) 76.58,43.91 83.57,36.93 R27.1
  Bottom Layer w0.254: U1.18 66.67,45.82 68.58,43.91 v1(70.1,43.91)
GPIO14: length 119.5
  Top Layer w0.254: ESW3.1 89.92,86.33 104.9,86.33 107.82,89.25 v1(107.82,90.01) 108.79,90.01 108.92,90.14 ; v1(88.77,71.09) 84.2,66.52 77.6,66.52 72.77,61.69 v1(61.59,61.69) ; v1(56.39,59.79) 50.91,54.31 LEFT.1
  Bottom Layer w0.254: RB.1 105.81,92.03 v1(107.82,90.01) 107.82,89.25 89.66,71.09 v1(88.77,71.09) ; U1.22 v1(61.59,61.69) 58.29,61.69 v1(56.39,59.79)
GPIO15: length 67.5
  Top Layer w0.254: v1(91.31,67.28) v1(87.12,67.28)
  Bottom Layer w0.254: v1(91.31,67.28) 96.52,67.28 111.25,82.01 119.67,82.01 120.06,81.63 120.06,71.9 D4.2 ; U1.8 72.46,76.17 78.23,76.17 v1(87.12,67.28)
GPIO16: length 41.9
  Top Layer w0.254: v1(52.96,67.41) 53.21,67.15 53.21,59.53 v1(52.96,59.28) ; v1(53.21,71.22) 54.48,72.49 v1(58.67,72.49)
  Bottom Layer w0.254: v1(53.21,71.22) 52.96,70.96 v1(52.96,67.41) ; U1.9 61.02,74.84 v1(58.67,72.49) ; D10.2 D11.2 D8.2 v1(52.96,59.28) 52.96,57.54 D9.2
GPIO17: length 126
  Top Layer w0.254: 61.35,86.46 44.07,86.46 42.29,84.68 ; 61.35,86.46 61.35,72.87 61.74,72.49 v1(62.1,72.49) ; 61.35,86.46 87.12,86.46 89.92,83.66 v1(97.79,83.66) ; 42.29,84.68 D12.2 ; 42.29,84.68 40.81,84.68 40.13,85.36 40.13,85.44
  Bottom Layer w0.254: v1(62.1,72.49) 62.48,72.49 63.22,73.22 72.05,73.22 U1.10 72.59,73.76 79.25,73.76 85.09,67.92 85.09,45.02 D13.2 ; v1(97.79,83.66) 98.64,83.66 D15.2
GPIO18: length 132.3
  Top Layer w0.254: D17.2 105.62,61.69 85.22,61.69 v1(83.18,63.73) ; v1(80.39,77.82) 79.25,76.68 v1(79.25,72.36) 80.26,71.35 D16.2 ; v1(50.8,84.68) 57.66,84.68 59.94,82.39 59.94,72.11 61.34,70.71 v1(63.75,70.71) ; v1(22.86,91.79) 22.99,91.92 D18.2
  Bottom Layer w0.254: v1(50.8,84.68) 48.01,84.68 44.96,87.73 35.31,87.73 33.02,90.01 25.4,90.01 23.62,91.79 v1(22.86,91.79) ; D19.2 86.83,81.21 83.44,77.82 v1(80.39,77.82) ; v1(83.18,63.73) 83.18,68.42 v1(79.25,72.36) 72.46,72.36 U1.11 71.52,72.3 69.93,70.71 v1(63.75,70.71)
GPIO21: length 30.8
  Top Layer w0.254: v1(62.1,73.5) 62.1,79.73 63.25,80.87 66.42,80.87 71.37,85.82 75.44,85.82 R22.2
  Bottom Layer w0.254: U1.23 60.33,71.73 v1(62.1,73.5)
GPIO38: length 15.9
  Top Layer w0.254: R25.2 63.6,83.01 v1(62.1,81.51)
  Bottom Layer w0.254: U1.31 58.61,73.57 62.1,77.06 v1(62.1,81.51)
GPIO39: length 71.3
  Bottom Layer w0.254: U3.7 57.8,36.18 57.02,35.4 38.61,35.4 36.83,37.18 36.83,61.06 45.59,69.82 49.53,69.82 49.9,70.19 R30.1 53.27,74.84 U1.32
GPIO40: length 75.2
  Bottom Layer w0.254: U3.6 59.07,36.18 57.78,34.9 38.1,34.9 35.81,37.18 35.81,61.06 47.62,72.87 49.15,72.87 49.9,73.62 R31.1 51.74,76.11 U1.33
GPIO45: length 51.6
  Bottom Layer w0.254: 41.77,37.18 41.66,37.06 41.66,36.55 41.15,36.04 39.24,36.04 37.85,37.44 37.85,60.93 43.18,66.27 55.69,66.27 56.52,67.09
  Bottom Layer w0.508: Q1.1 41.84,37.25 41.77,37.18
GPIO46: length 40.2
  Top Layer w0.254: v1(57.66,64.11) 67.56,64.11 v1(69.21,65.76)
  Bottom Layer w0.254: v1(69.21,65.76) U1.16 ; D1.1 39.5,55.98 46.86,63.34 56.9,63.34 v1(57.66,64.11)
GPIO47: length 25.8
  Top Layer w0.254: R23.2 72.64,62.58 v1(59.05,62.58)
  Bottom Layer w0.254: v1(59.05,62.58) U1.24
GPIO48: length 6.3
  Top Layer w0.254: v1(57.91,68.81) 58.57,69.47 R24.2
  Bottom Layer w0.254: v1(57.91,68.81) 57.91,67.22 U1.25
LB_2: length 4.7
  Top Layer w0.254: D14.1 40.26,89.27 LB.2
LEFT_2: length 7.7
  Top Layer w0.254: 40.28,56.23 v1(44.2,56.23)
  Bottom Layer w0.254: v1(44.2,56.23) 46.9,56.23 D11.1
LS_2: length 12.1
  Top Layer w0.254: 45.59,84.55 45.59,83.79 43.4,81.6 LS.d LS.c
RB_2: length 6.2
  Bottom Layer w0.254: D15.1 100.58,88.83 100.58,90.42 RB.2
RESET: length 11.5
  Bottom Layer w0.254: 83.21,80.78 82.1,81.89 73.98,81.89 73.4,82.46 U1.3
RIGHT_2: length 6.1
  Top Layer w0.254: 60.05,56.19 60.07,56.21 v1(60.07,58.26)
  Bottom Layer w0.254: D9.1 57.49,58.26 v1(60.07,58.26)
RS_2: length 9.8
  Bottom Layer w0.254: RS.d RS.c 87.3,40.74 84.24,40.74
RXD0: length 150.9
  电源层 w0.254: UART0.2 77.72,35.91 78.74,36.93 82.93,36.93 83.95,35.91 93.73,35.91 101.33,43.51 107.68,43.51 114.28,50.11 117.07,50.11 121.82,54.86 121.82,67.13 103,85.95 62.48,85.95 56.45,79.92 v1(50.8,79.92)
  Bottom Layer w0.254: U1.36 v1(50.8,79.92)
SCL: length 41.8
  Top Layer w0.254: U22.23 68.84,56.74 v1(68.45,57.12)
  电源层 w0.254: v1(68.45,57.12) 68.45,60.8 58.04,71.22 56.01,71.22 50.67,76.55 v1(50.67,77.63)
  Bottom Layer w0.254: 72.77,54.06 72.53,53.82 69.47,53.82 68.45,54.84 v1(68.45,57.12) ; v1(50.67,77.63) 54.35,77.63 U1.34
SDA: length 43.3
  Top Layer w0.254: v1(67.56,56.61) 67.94,56.24 U22.24
  电源层 w0.254: v1(49.53,78.58) 49.53,76.55 55.63,70.46 57.66,70.46 67.56,60.55 v1(67.56,56.61)
  Bottom Layer w0.254: 68.47,51.91 68.33,51.91 67.56,52.68 v1(67.56,56.61) ; v1(49.53,78.58) 49.59,78.65 U1.35
START_2: length 7.6
  Top Layer w0.254: D16.1 85.22,71.35 86.23,72.36 86.23,74.76 START.2
TXD0: length 146.4
  电源层 w0.254: v1(51.94,81.19) 56.58,81.19 61.98,86.59 103.25,86.59 122.43,67.41 122.43,54.58 117.22,49.37 114.55,49.37 108.08,42.9 101.6,42.9 93.98,35.28 80.39,35.28 UART0.1
  Bottom Layer w0.254: U1.37 v1(51.94,81.19)
UP_2: length 4.8
  Top Layer w0.254: v1(46.61,59.41) 46.61,62.71 46.89,62.99
  Bottom Layer w0.254: v1(46.61,59.41) 47.54,59.41 D8.1
VUSB: length 40
  电源层 w0.508: v1(73.15,41.63) v1(68.33,41.63) 68.33,43.15 62.48,48.99 v1(54.36,48.99)
  Bottom Layer w0.508: 66.81,43.14 66.83,43.13 v1(68.33,41.63) ; USB1.11 68.34,41.54 ; USB1.2 v1(73.15,41.63) ; R13.2 45.45,48.22 45.45,46.26 45.7,46.26 47.01,47.57 49.02,47.57 50.44,48.99 v1(54.36,48.99)
VUSB_OR_VBAT: length 117.7
  Top Layer w0.508: v1(56.77,47.98) 56.77,45.18 59.18,42.77 75.95,42.77 84.45,34.26 103.12,34.26 103.44,34.58 103.44,35.66 103.76,35.66 104.77,36.67 MOT2.2 ; C15.2 21.91,51.7 23.6,50.01 24,50.01
  电源层 w0.508: v1(56.77,47.98) v1(55.12,47.98) 49.28,42.14 43.05,42.14 40,45.18 27.3,45.18 24.89,47.6 24.89,48.99 MOT1.2
  Bottom Layer w0.508: U2.1 51.01,42.58 51.39,42.96 ; R14.1 53.59,42.25 52.89,42.96 52,42.96 ; U4.2 45.62,44.32 50.03,44.32 51.39,42.96 ; 52,42.96 51.39,42.96 ; 52,42.96 52.07,43.03 52.07,45.33 52.69,45.95 53.09,45.95 v1(55.12,47.98)
X_2: length 11
  Bottom Layer w0.254: D6.1 105.11,85.4 v1(101.85,82.14)
XSCL: length 9.9
  Top Layer w0.254: 77.85,50.78 77.85,50.39 77.34,49.88 75.71,49.88 75.18,50.41 v1(75.18,50.77) ; v1(74.68,52.68) 74.42,52.68 74.09,53.01 U22.7
  Bottom Layer w0.254: v1(75.18,50.77) 75.18,52.17 v1(74.68,52.68)
XSDA: length 6.8
  Top Layer w0.254: 73.21,55.36 73.21,52.75 74.28,51.67 U23.16
Y_2: length 5.5
  Bottom Layer w0.254: D7.1 116.97,87.43 v1(116.97,90.01)
$1N1324: length 1.7
  Bottom Layer w0.508: 54.61,45.43 56.24,45.43 56.28,45.39
$1N1328: length 2.5
  Bottom Layer w0.508: 58.04,45.62 58.04,44.29 57.8,44.05 U3.2
$1N2751: length 2.5
  Bottom Layer w0.508: U2.3 51.14,40.62 R14.2
$1N3780: length 16.6
  电源层 w0.508: v1(42.29,40.87) 43.18,40.87 44.96,39.09 v1(46.48,39.09)
  Bottom Layer w0.508: D3.1 40.89,41.67 Q1.3 40.89,40.74 41.02,40.87 v1(42.29,40.87) ; 53.59,39.12 53.37,38.89 51.17,38.89 50.97,39.09 v1(46.48,39.09)
$1N3912: length 66.2
  Top Layer w0.254: v1(55.88,64.11) 54.99,65 54.99,66.27 56.9,68.17 v1(56.9,69.44) ; v1(40.64,47.6) 36.58,47.6 32.26,51.91 32.26,55.98 34.92,58.65 38.35,58.65 v1(39.75,60.04)
  Bottom Layer w0.254: v1(40.64,47.6) 39.54,47.6 D1.2 ; v1(39.75,60.04) 43.81,64.11 v1(55.88,64.11) ; v1(70.74,74.01) 70.48,74.27 61.59,74.27 56.9,69.57 v1(56.9,69.44)
  Bottom Layer w0.508: D3.2 D1.2
$1N8434: length 3.9
  Top Layer w0.254: v1(72.26,38.71) 73.27,37.7 R19.2
  Bottom Layer w0.254: 71.99,39.81 71.99,38.98 v1(72.26,38.71)
$1N8460: length 4.4
  Top Layer w0.254: R20.2 68.21,37.45 v1(69.47,38.71)
  Bottom Layer w0.254: USB1.10 68.99,39.19 v1(69.47,38.71)
$1N17335: length 1.7
  Top Layer w0.254: 77.59,83.61 77.59,83.49 green1.2
$1N17361: length 3.8
  Top Layer w0.254: green2.2 79.15,69.33 R23.1
$1N17387: length 3.7
  Top Layer w0.254: R24.1 65.81,70.94 green3.2
$1N17413: length 1.7
  Top Layer w0.254: R25.1 64.79,84.45 green4.2
$1N18714: length 7.5
  Top Layer w0.508: 27.19,47.47 26.54,47.47 26.54,50.14 25.15,51.53 24.19,51.53 C15.1
$1N18779: length 5.3
  Top Layer w0.254: 29.19,46.52 30.13,45.58 R4.2 34.02,45.58 34.04,45.56 R2.1
$1N18990: length 4.7
  Top Layer w0.508: Q3.3 102.11,38.2 102.23,38.33 102.23,35.85 C16.1
$1N18998: length 6.1
  Top Layer w0.254: 96.01,38.82 96.34,39.15 97.93,39.15 ; R27.2 93.38,36.93 95.53,39.07 95.89,39.07
$1N25608: length 6.4
  Top Layer w0.254: D17.1 107.57,50.27 ESW1.2
$1N25630: length 2.5
  Top Layer w0.254: ESW2.2 D18.1
$1N25649: length 2.6
  Bottom Layer w0.254: D19.1 83.57,87.56 ESW3.2
$1N28110: length 20.9
  电源层 w0.508: v1(55.32,37.4) 55.32,41.83 56.71,43.22 59.67,43.22 60.88,44.42 v1(61.59,44.42)
  Bottom Layer w0.508: U3.8 v1(55.32,37.4) ; 62.39,46.6 62.39,45.22 v1(61.59,44.42) ; v1(61.59,44.42) 61.54,44.42 U3.4 ; v1(61.59,44.42) 62.5,44.42 64.02,42.9 R6.2
$1N35263: length 5
  Top Layer w0.254: v1(75.69,59.53) 75.69,58.52 74.91,57.74 U22.10
  Bottom Layer w0.254: v1(75.69,59.53) C19.1
$1N35470: length 4.6
  Top Layer w0.254: U22.20 69.31,58.24 68.83,58.71 68.83,59.79 69.47,60.42 v1(69.6,60.42)
  Bottom Layer w0.254: C21.2 69.15,60.87 v1(69.6,60.42)
$1N35689: length 6.8
  Top Layer w0.254: U23.8 81.28,54.2 81.28,58.26 81.03,58.52 80.08,58.52
$1N35693: length 5.3
  Top Layer w0.254: U23.12 77.86,54.57 77.47,54.96 77.47,57.63 78.36,58.52 C22.2
$1N35727: length 2.5
  Top Layer w0.254: U23.10 78.86,56.3 C23.1

## Copper pours and planes (outline as drawn; the poured copper is in the pictures)
GND on 电源层: 6.22,98.27 134.37,98.27 134.37,26.13 6.22,26.13
GND on GND: 4.83,99.03 132.08,99.03 132.08,28.29 4.83,28.29

## Text on the board
Bottom Silkscreen Layer: RX0 | TX0 | B- | B+
